# Altium project PCB_Project1.PrjPCB
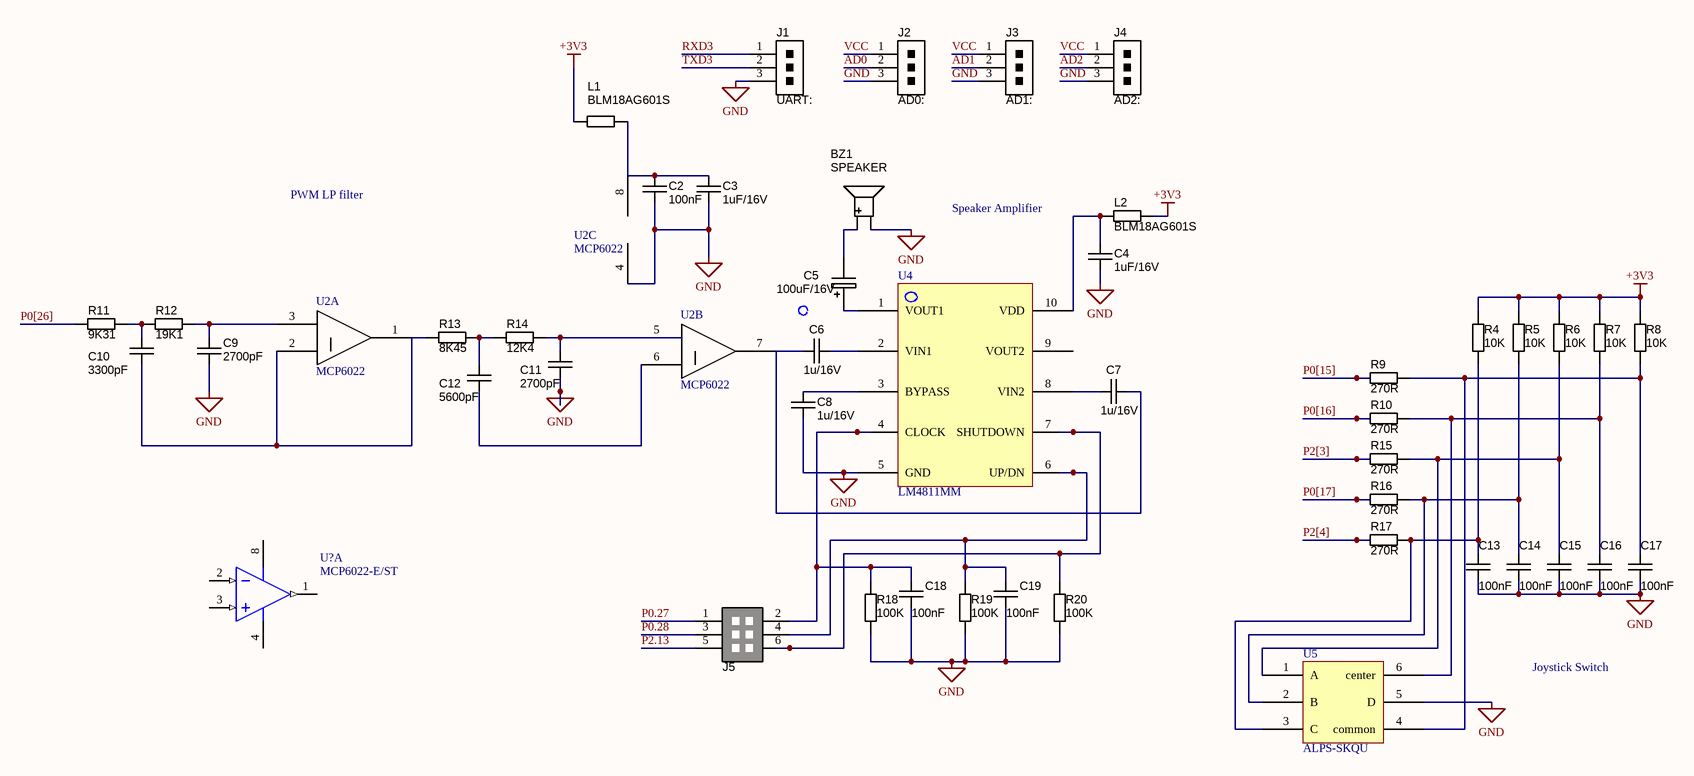
[diagram p0: Base Board.SchDoc]
6 sheets, 164 parts. Net scope: global (net labels, ports and power ports of the same name join across sheets).
Board file: PCB1.PcbDoc
Sheets:
  Base Board.SchDoc
  LPC1769.SchDoc
  SPI peripherals.SchDoc
  I2C-E2PROM.SchDoc
  USB Device.SchDoc
  Etherent.SchDoc

## Sheet Base Board.SchDoc
size A3; : 輸出入介面電路

### Parts
(Parts that share a designator on the sheet are numbered #1, #2 ... from top to bottom, then left to right.)
BZ1  Manufacturer Part Number 1: SPEAKER  [BUZZER_12.0X8.5MM]  (hidden comment: Alternate part: 3100-932)
C2  value 100nF  [CAPC2012N]  (hidden comment: approved sub OK)
C3  value 1uF/16V  [CAPC2012N]  (hidden comment: approved sub OK)
C4  value 1uF/16V  [CAPC2012N]  (hidden comment: approved sub OK)
C5  (no value)  [CAPMP3528X210N]
C6#1  value 1u/16V  [CAPC2012N]  (hidden comment: approved sub OK)
C7#1  value 1u/16V  [CAPC2012N]  (hidden comment: approved sub OK)
C8#1  value 1u/16V  [CAPC2012N]  (hidden comment: approved sub OK)
C9#1  value 2700pF  [CAPC2012N]  (hidden comment: approved sub OK)
C10#1  value 3300pF  [CAPC2012N]  (hidden comment: approved sub OK)
C11#1  value 2700pF  [CAPC2012N]  (hidden comment: approved sub OK)
C12#1  value 5600pF  [CAPC2012N]  (hidden comment: approved sub OK)
C13#1  value 100nF  [CAPC2012N]  (hidden comment: approved sub OK)
C14#1  value 100nF  [CAPC2012N]  (hidden comment: approved sub OK)
C15#1  value 100nF  [CAPC2012N]  (hidden comment: approved sub OK)
C16#1  value 100nF  [CAPC2012N]  (hidden comment: approved sub OK)
C17#1  value 100nF  [CAPC2012N]  (hidden comment: approved sub OK)
C18#1  value 100nF  [CAPC2012N]  (hidden comment: approved sub OK)
C19#1  value 100nF  [CAPC2012N]  (hidden comment: approved sub OK)
J1#1  CONN_HEADER_1x3P_0.100in  [1x3POS_HEADER]  (value not drawn)
J2#1  CONN_HEADER_1x3P_0.100in  [1x3POS_HEADER]  (value not drawn)
J3#1  CONN_HEADER_1x3P_0.100in  [1x3POS_HEADER]  (value not drawn)
J4  CONN_HEADER_1x3P_0.100in  [1x3POS_HEADER]  (value not drawn)
J5  micro-match socket  [6P_PCB_SOCKET_BRD_MNT_MICRO-MATCH]  (value not drawn)
L1  value BLM18AG601S  [RESC2012N]  (hidden comment: Thick Film)
L2  value BLM18AG601S  [RESC2012N]  (hidden comment: Thick Film)
R4  value 10K  [RESC2012N]  (hidden comment: Thick Film)
R5  value 10K  [RESC2012N]  (hidden comment: Thick Film)
R6  value 10K  [RESC2012N]  (hidden comment: Thick Film)
R7  value 10K  [RESC2012N]  (hidden comment: Thick Film)
R8  value 10K  [RESC2012N]  (hidden comment: Thick Film)
R9  value 270R  [RESC1005N]  (hidden comment: Thick Film)
R10  value 270R  [RESC1005N]  (hidden comment: Thick Film)
R11  value 9K31  [RESC1005N]  (hidden comment: Thick Film)
R12  value 19K1  [RESC1005N]  (hidden comment: Thick Film)
R13  value 8K45  [RESC1005N]  (hidden comment: Thick Film)
R14  value 12K4  [RESC1005N]  (hidden comment: Thick Film)
R15  value 270R  [RESC1005N]  (hidden comment: Thick Film)
R16  value 270R  [RESC1005N]  (hidden comment: Thick Film)
R17#1  value 270R  [RESC1005N]  (hidden comment: Thick Film)
R18#1  value 100K  [RESC1005N]  (hidden comment: Thick Film)
R19#1  value 100K  [RESC1005N]  (hidden comment: Thick Film)
R20#1  value 100K  [RESC1005N]  (hidden comment: Thick Film)
U2#1  MCP6022  [MSOP-UA8_L]  (parts A,B,C of 3)
U4#1  LM4811MM  [MSOP-UN10_N]
U5#1  ALPS-SKQU  [SOT-23-CH6_L]
U?  MCP6022-E/ST  [TSSOP-ST8_N]  (part A of 2)

### Nets
+3V3: L1.1 L2.2 R4.1 R5.1 R6.1 R7.1 R8.1
GND: BZ1.2(Negative) C2.1 C3.1 C4.1 C8#1.1 C9#1.2 C11#1.2 C13#1.2 C14#1.2 C15#1.2 C16#1.2 C17#1.2 C18#1.2 C19#1.2 J1#1.3 J2#1.3 J3#1.3 J4.3 R18#1.1 R19#1.1 R20#1.1 U4#1.5(GND) U5#1.5(D)
VCC: J2#1.1 J3#1.1 J4.1
AD0: J2#1.2
AD1: J3#1.2
AD2: J4.2
P0.27: J5.1
P0.28: J5.3
P0[15]: R9.1
P0[16]: R10.1
P0[17]: R16.1
P0[26]: R11.1
P2.13: J5.5
P2[3]: R15.1
P2[4]: R17#1.1  [project net BTN_DOWN]
RXD3: J1#1.1
TXD3: J1#1.2
NetBZ1_1: BZ1.1(Positive) C5.2
NetC2_2: C2.2 C3.2 L1.2
NetC4_2: C4.2 L2.1 U4#1.10(VDD)
NetC5_1: C5.1 U4#1.1(VOUT1)
NetC6#1_1: C6#1.1 C7#1.2
NetC6#1_2: C6#1.2 U4#1.2(VIN1)
NetC7#1_1: C7#1.1 U4#1.8(VIN2)
NetC8#1_2: C8#1.2 U4#1.3(BYPASS)
NetC9#1_1: C9#1.1 R12.2
NetC10#1_1: C10#1.1 R11.2 R12.1
NetC10#1_2: C10#1.2 R13.2
NetC11#1_1: C11#1.1 R14.2 U2#1.5(VINB+)
NetC12#1_1: C12#1.1 R13.1 R14.1
NetC13#1_1: C13#1.1 R4.2 R17#1.2 U5#1.3(C)
NetC14#1_1: C14#1.1 R5.2 R16.2 U5#1.2(B)
NetC15#1_1: C15#1.1 R6.2 R15.2 U5#1.1(A)
NetC16#1_1: C16#1.1 R7.2 R10.2 U5#1.6(center)
NetC17#1_1: C17#1.1 R8.2 R9.2 U5#1.4(common)
NetC18#1_1: C18#1.1 J5.2 R18#1.2 U4#1.4(CLOCK)
NetC19#1_1: C19#1.1 J5.4 R19#1.2 U4#1.6(UP/DN)
NetJ5_6: J5.6 R20#1.2 U4#1.7(SHUTDOWN)

Not connected (* = marked no-connect by the designer): C12#1 2; U2#1 1(VOUTA) 2(VINA-) 3(VINA+) 4(GND) 6(VINB-) 7(VOUTB) 8(VDD); U4#1 9(VOUT2); U? 1(VOUTA) 2(VINA-) 3(VINA+) 4(VSS) 8(VDD)

### Notes on the sheet
- PWM LP filter
- Speaker Amplifier
- Joystick Switch
- (in symbol CAPT_100u_1210_6V3) 100uF/16V

### Library data of the parts
BZ1 = BZ_12x8.5x6.5_2kHz: Speaker, Magnetic Transducer; Manufacturer 1: CUI Inc; Ratings: 2048 ?00 Hz; Package / Case: 6.5mm pitch; Material: Noryl SE1-J; Supplier 1: Digi-Key; Supplier Part Number 1: 102-1152-ND
C2-C4 C6#1 C7#1 C8#1 C9#1 C10#1 C11#1 C12#1 C13#1 C14#1 C15#1 C16#1 C17#1 C18#1 C19#1 = CAPC_100n_0805: Capacitor SMD Cer 100nF 10% 50V X7R 0805; Manufacturer 1: Kemet; Manufacturer Part Number 1: C0805C104K5RACTU; Tolerance: ?0%; Ratings: 50V; X7R; Material: ceramic; Package / Case: 0805 (2012 metric); Supplier 1: Digi-Key; Supplier Part Number 1: 399-1170-1-ND
C5 = CAPT_100u_1210_6V3: Capacitor SMD Tantalum 100uF 20% 6.3V 1210; Manufacturer 1: AVX Corporation; Manufacturer Part Number 1: TCJB107M006R0045; Tolerance: ?0%; Package / Case: 1210 (3528 Metric); Material: Tantalum; Supplier 1: Digi-Key; Supplier Part Number 1: 478-4711-1-ND
J1#1 J2#1 J3#1 J4 = CONN_HEADER_1x3P_0.100in: Pin Header, THT, Single-row, 2.54mm pitch; Manufacturer 1: 3M; Manufacturer Part Number 1: 929647-09-36-I; Pitch: 0.100" (2.54mm); Value: Single-row, 3 positions; QtyOverride: 0.1; Category: Connectors; Mounting Type: Through Hole; Terminal Block Type: Header, Male Pins, Single; Package / Case: Pin header; 2.54mm pitch
J5 = CONN_SOCKET_2x3P_0.100in_Female: Socket THD 6 POS Double-row 2.54mm pitch; Manufacturer 1: TE Connectivity; Manufacturer Part Number 1: 7-215079-6; Pitch: 0.100" (2.54mm); Value: Double-row, 14 positions; QtyOverride: 1; Connector Type: Receptacle; Number of Positions: 6; Package / Case: Connector header; 2.54mm pitch; Contact Type: Female Socket; Number of Rows: 2; Row Spacing: 0.100" (2.54mm); Contact Mating Length: 0.243" (6.17mm); ComponentLink1URL: http://multimedia.3m.com/mws/mediawebserver?66666UuZjcFSLXTtm8T_oxMcEVuQEcuZgVs6EVs6E666666--; ComponentLink1Description: http://multimedia.3m.com/mws/mediawebserver?66666UuZjcFSLXTtm8T_oxMcEVuQEcuZgVs6EVs6E666666--; Supplier 1: Digi-Key; Supplier Part Number 1: A30729CT-ND
L1 L2 R4-R8 = RES_10K_0805_5%: Resistor SMD chip 10k Ohm 0.125W 5% 0805; Manufacturer 1: Yageo; Manufacturer Part Number 1: RC0805JR-0710KL; Ratings: 1/8 W; Tolerance: ?%; Package / Case: 0805 (2012 metric); Material: Thick Film; Supplier 1: Digi-Key; Supplier Part Number 1: 311-10KARCT-ND
R9-R16 R17#1 R18#1 R19#1 R20#1 = RES_330R_0402_5%: Resistor SMD chip 330 Ohm 0.063W 5% 0402; Manufacturer 1: Yageo; Manufacturer Part Number 1: RC0402JR-07330RL; Ratings: 1/16 W; Tolerance: ?%; Package / Case: 0402 (1005 Metric); Supplier 1: Digi-Key; Supplier Part Number 1: 311-330JRCT-ND; ComponentLink1URL: http://www.yageo.com/documents/recent/PYu-RC0402_51_RoHS_L_6.pdf; ComponentLink1Description: http://www.yageo.com/documents/recent/PYu-RC0402_51_RoHS_L_6.pdf
U? = MCP6022-E/ST: Rail-to-Rail Input/Output, 10 MHz Operational Amplifier, 8-Pin TSSOP, Extended Temperature; Manufacturer: Microchip; DatasheetVersion: revD, Feb-2009; PackageVersion: revBB, Aug-2009; PackageReference: TSSOP-ST8; PackageDescription: 8-Lead Plastic Thin Shrink Small Outline (ST) - 4.4mm Body [TSSOP]; Supplier 1: Digi-Key; Supplier Part Number 1: MCP6022-E/ST-ND; Supplier 2: Farnell; Supplier Part Number 2: 1840887; Supplier 3: Newark; Supplier Part Number 3: 88H9882; Supplier 4: Mouser; Supplier Part Number 4: 579-MCP6022-E/ST; Mounting Technology: Surface Mount; Code_JEDEC: MO-153; PartNumber: MCP6022-E/ST; ComponentLink1Description: Manufacturer URL; ComponentLink1URL: http://www.microchip.com/; ComponentLink2Description: Datasheet; ComponentLink2URL: http://ww1.microchip.com/downloads/en/DeviceDoc/21685d.pdf; ComponentLink3Description: Package Specification; ComponentLink3URL: http://www.microchip.com/stellent/groups/techpub_sg/documents/packagingspec/en012702.pdf

## Sheet LPC1769.SchDoc: Motor Monitoring
size A3; Organization: NTUST EE-305; Address1: No.43, Sec. 4, Keelung Rd.; Address2: Da’an Dist.; Address3: Taipei 106; Address4: Taiwan (R.O.C.); Revision: 2.0; SheetNumber: 1; SheetTotal: 4
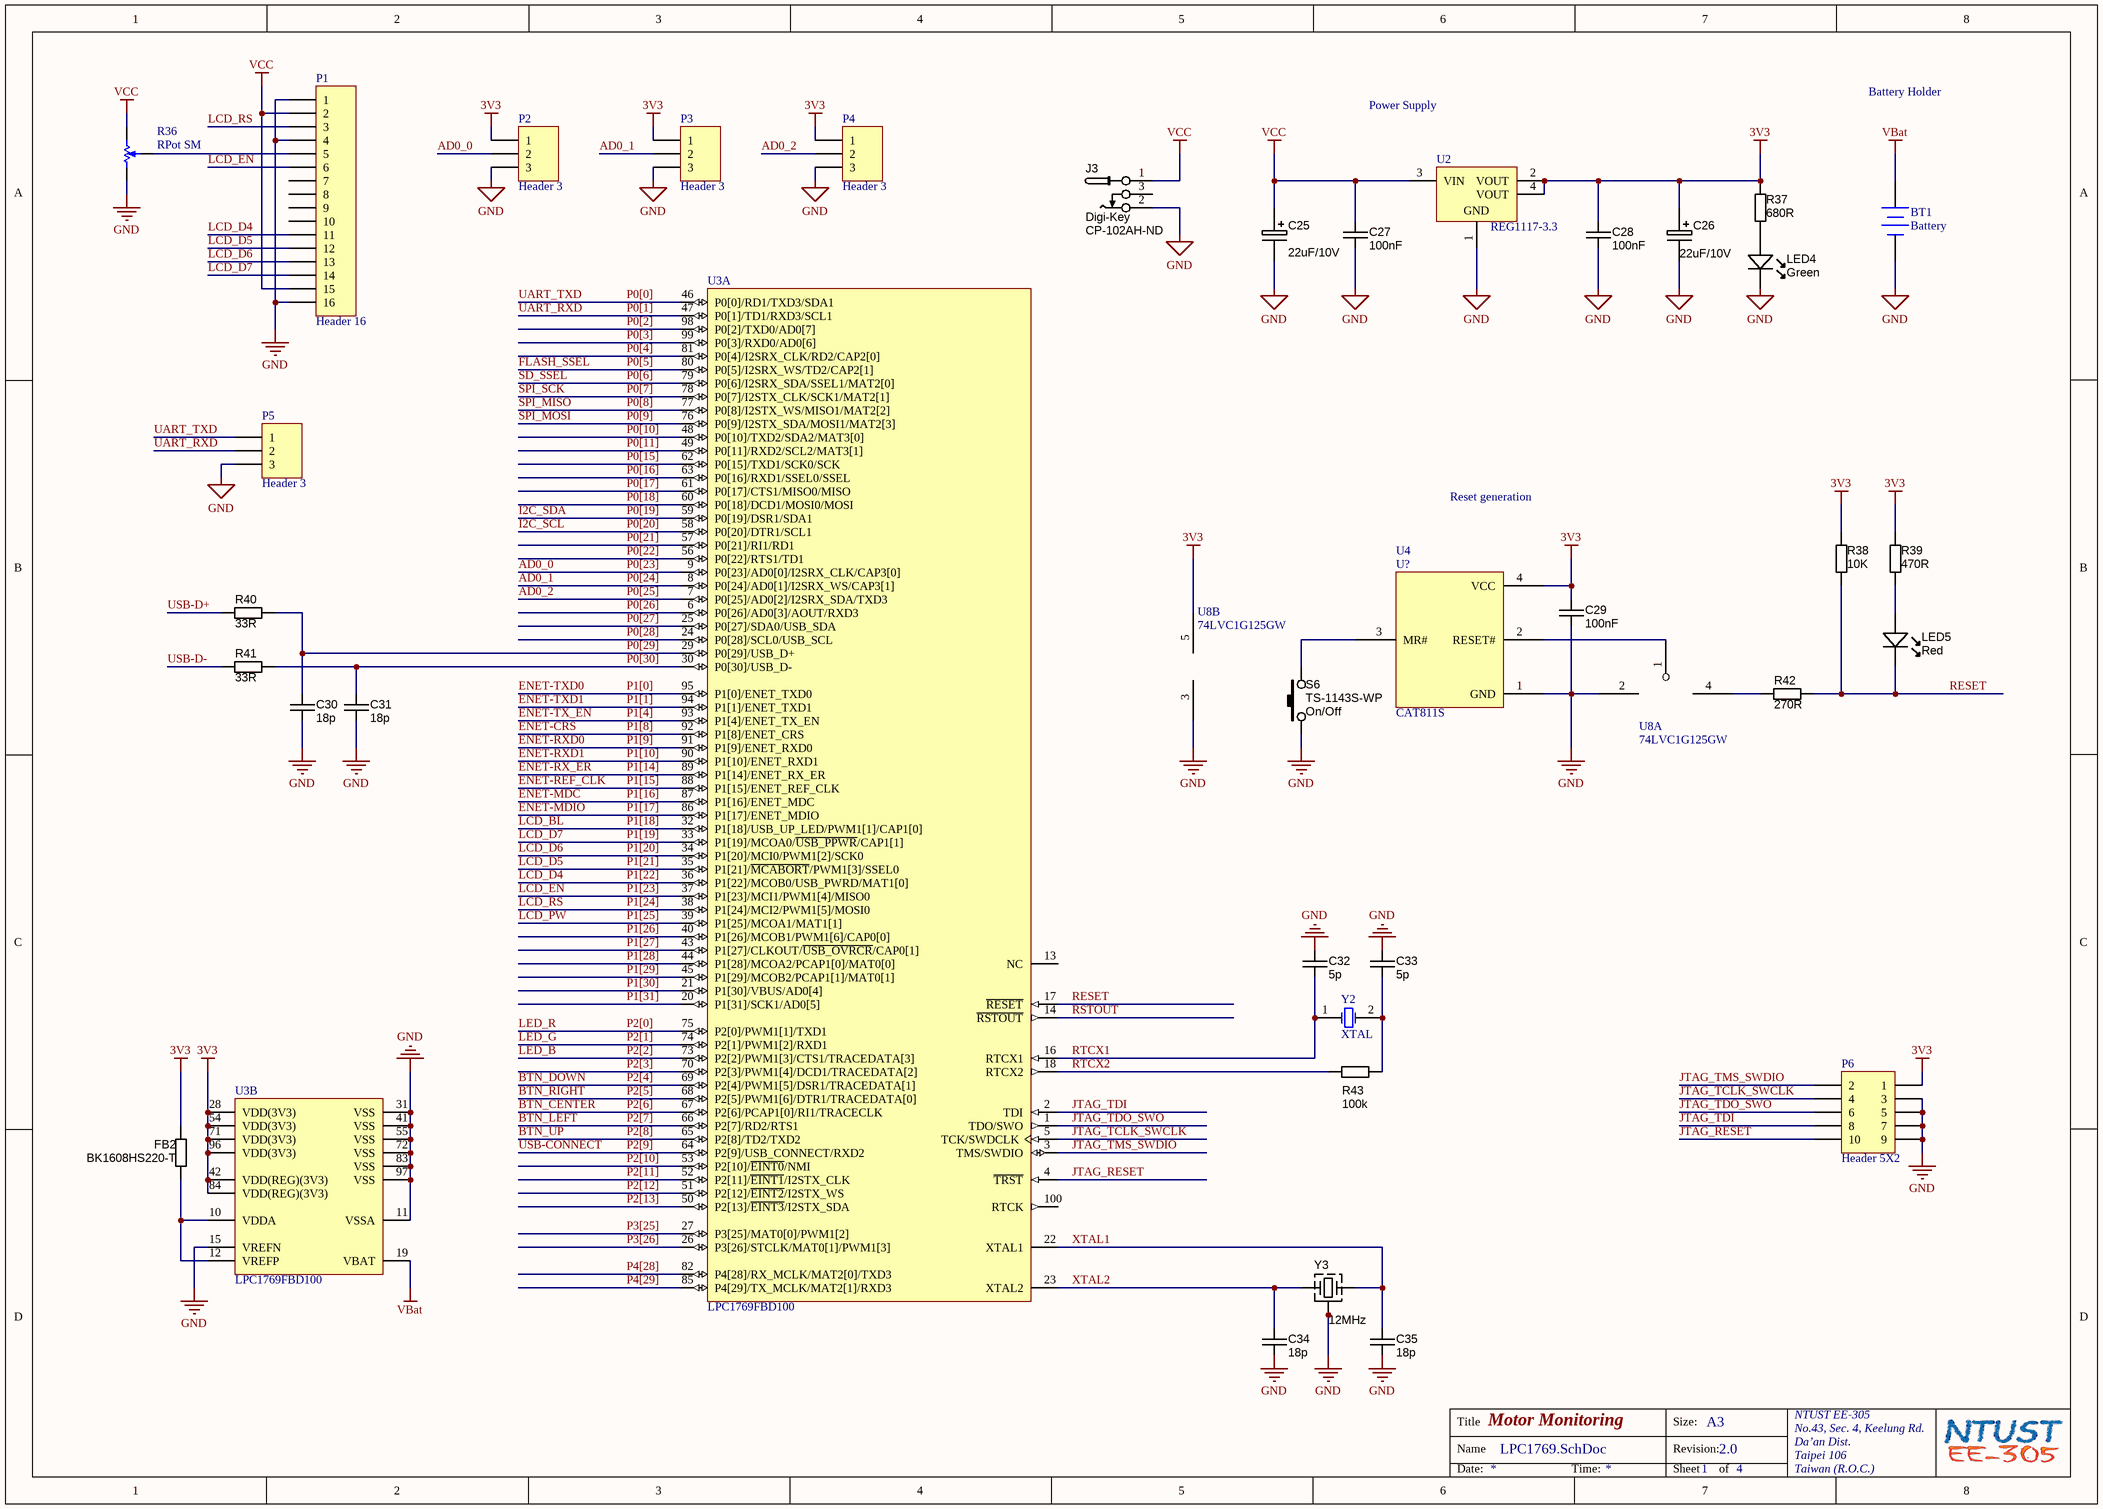
[diagram p1: LPC1769.SchDoc]

### Parts
(Parts that share a designator on the sheet are numbered #1, #2 ... from top to bottom, then left to right.)
BT1  Battery  [BAT-2]
C25  (no value)  [CAP_ELEC_5x5.7]
C26  (no value)  [CAP_ELEC_5x5.7]
C27  value 100nF  [CAPC1608N]  (hidden comment: approved sub OK)
C28  value 100nF  [CAPC1608N]  (hidden comment: approved sub OK)
C29  value 100nF  [CAPC1005N]  (hidden comment: approved sub OK)
C30  value 18p  [CAPC1608N]  (hidden comment: approved sub OK)
C31  value 18p  [CAPC1608N]  (hidden comment: approved sub OK)
C32  value 5p  [CAPC1005N]  (hidden comment: approved sub OK)
C33  value 5p  [CAPC1005N]  (hidden comment: approved sub OK)
C34  value 18p  [CAPC1005N]  (hidden comment: approved sub OK)
C35  value 18p  [CAPC1005N]  (hidden comment: approved sub OK)
FB2  value BK1608HS220-T  [RESC2012N]  (hidden comment: Thick Film)
J3#2  Supplier 1: Digi-Key  Supplier Part Number 1: CP-102AH-ND  [CONN_PWR_JACK_2.1x5.5mm]  (hidden comment: CONN_PWR_JACK_2.1x5.5mm)
LED4  Green  [LED-0603-GREEN]
LED5  Red  [LED-0603-GREEN]
P1  Header 16  [HDR1X16]
P2  Header 3  [HDR1X3]
P3  Header 3  [HDR1X3]
P4  Header 3  [HDR1X3]
P5  Header 3  [HDR1X3]
P6  Header 5X2  [Header 5x2p]
R36  RPot SM  [POT4MM-2]
R37  value 680R  [RESC1005N]  (hidden comment: Thick Film)
R38  value 10K  [RESC1005N]  (hidden comment: Thick Film)
R39#1  value 470R  [RESC1005N]  (hidden comment: Thick Film)
R40#1  value 33R  [RESC1608N]  (hidden comment: Thick Film)
R41  value 33R  [RESC1608N]  (hidden comment: Thick Film)
R42  value 270R  [RESC1005N]  (hidden comment: Thick Film)
R43  value 100k  [RESC1005N]  (hidden comment: Thick Film)
S6  TS-1143S-WP  Function: On/Off  [TS-1143S]
U2#2  REG1117-3.3  [TI-DCY4_N]
U3  LPC1769FBD100  [SOT407-1_V]  (parts A,B of 2)
U4#2  CAT811S  [SOT-143-RC4_N]
U8  74LVC1G125GW  [SOT-23-CT5_N]  (parts A,B of 2)
Y2  XTAL  [HC49/4H_SMX]
Y3  12MHz  [CRYSTAL_4-LCC]

### Nets
3V3: C26.1 C28.2 C29.1 FB2.2 P2.1 P3.1 P4.1 P6.1 R37.2 R38.2 R39#1.2 U2#2.2(VOUT) U2#2.4(VOUT) U3.28(VDD(3V3)) U3.42(VDD(REG)(3V3)) U3.54(VDD(3V3)) U3.71(VDD(3V3)) U3.84(VDD(REG)(3V3)) U3.96(VDD(3V3)) U4#2.4(VCC) U8.5(VCC)
GND: BT1.2(-) C25.2 C26.2 C27.2 C28.1 C29.2 C30.1 C31.1 C32.2 C33.2 C34.1 C35.1 J3#2.2 LED4.K P1.1 P1.4 P1.16 P2.3 P3.3 P4.3 P5.3 P6.3 P6.5 P6.7 P6.9 R36.CCW(-) S6.1 U2#2.1(GND) U3.11(VSSA) U3.15(VREFN) U3.31(VSS) U3.41(VSS) U3.55(VSS) U3.72(VSS) U3.83(VSS) U3.97(VSS) U4#2.1(GND) U8.2(A) U8.3(GND) Y3.2(GND) Y3.4(GND)
VBat: BT1.1(+) U3.19(VBAT)
VCC: C25.1 C27.1 J3#2.1 P1.2 P1.15 R36.CW(+) U2#2.3(VIN)
AD0_0: P2.2 U3.9(P0[23]/AD0[0]/I2SRX_CLK/CAP3[0])  [also labelled P0[23]]
AD0_1: P3.2 U3.8(P0[24]/AD0[1]/I2SRX_WS/CAP3[1])  [also labelled P0[24]]
AD0_2: P4.2 U3.7(P0[25]/AD0[2]/I2SRX_SDA/TXD3)  [also labelled P0[25]]
BTN_CENTER: U3.67(P2[6]/PCAP1[0]/RI1/TRACECLK)  [also labelled P2[6]]
BTN_DOWN: U3.69(P2[4]/PWM1[5]/DSR1/TRACEDATA[1])  [also labelled P2[4]]
BTN_LEFT: U3.66(P2[7]/RD2/RTS1)  [also labelled P2[7]]
BTN_RIGHT: U3.68(P2[5]/PWM1[6]/DTR1/TRACEDATA[0])  [also labelled P2[5]]
BTN_UP: U3.65(P2[8]/TD2/TXD2)  [also labelled P2[8]]
ENET-CRS: U3.92(P1[8]/ENET_CRS)  [also labelled P1[8]]
ENET-MDC: U3.87(P1[16]/ENET_MDC)  [also labelled P1[16]]
ENET-MDIO: U3.86(P1[17]/ENET_MDIO)  [also labelled P1[17]]
ENET-REF_CLK: U3.88(P1[15]/ENET_REF_CLK)  [also labelled P1[15]]
ENET-RX_ER: U3.89(P1[14]/ENET_RX_ER)  [also labelled P1[14]]
ENET-RXD0: U3.91(P1[9]/ENET_RXD0)  [also labelled P1[9]]
ENET-RXD1: U3.90(P1[10]/ENET_RXD1)  [also labelled P1[10]]
ENET-TX_EN: U3.93(P1[4]/ENET_TX_EN)  [also labelled P1[4]]
ENET-TXD0: U3.95(P1[0]/ENET_TXD0)  [also labelled P1[0]]
ENET-TXD1: U3.94(P1[1]/ENET_TXD1)  [also labelled P1[1]]
FLASH_SSEL: U3.80(P0[5]/I2SRX_WS/TD2/CAP2[1])  [also labelled P0[5]]
I2C_SCL: U3.58(P0[20]/DTR1/SCL1)  [also labelled P0[20]]
I2C_SDA: U3.59(P0[19]/DSR1/SDA1)  [also labelled P0[19]]
JTAG_RESET: P6.10 U3.4(~{TRST})
JTAG_TCLK_SWCLK: P6.4 U3.5(TCK/SWDCLK)
JTAG_TDI: P6.8 U3.2(TDI)
JTAG_TDO_SWO: P6.6 U3.1(TDO/SWO)
JTAG_TMS_SWDIO: P6.2 U3.3(TMS/SWDIO)
LCD_BL: U3.32(P1[18]/USB_UP_LED/PWM1[1]/CAP1[0])  [also labelled P1[18]]
LCD_D4: P1.11 U3.36(P1[22]/MCOB0/USB_PWRD/MAT1[0])  [also labelled P1[22]]
LCD_D5: P1.12 U3.35(P1[21]/~{MCABORT}/PWM1[3]/SSEL0)  [also labelled P1[21]]
LCD_D6: P1.13 U3.34(P1[20]/MCI0/PWM1[2]/SCK0)  [also labelled P1[20]]
LCD_D7: P1.14 U3.33(P1[19]/MCOA0/~{USB_PPWR}/CAP1[1])  [also labelled P1[19]]
LCD_EN: P1.6 U3.37(P1[23]/MCI1/PWM1[4]/MISO0)  [also labelled P1[23]]
LCD_PW: U3.39(P1[25]/MCOA1/MAT1[1])  [also labelled P1[25]]
LCD_RS: P1.3 U3.38(P1[24]/MCI2/PWM1[5]/MOSI0)  [also labelled P1[24]]
LED_B: U3.73(P2[2]/PWM1[3]/CTS1/TRACEDATA[3])  [also labelled P2[2]]
LED_G: U3.74(P2[1]/PWM1[2]/RXD1)  [also labelled P2[1]]
LED_R: U3.75(P2[0]/PWM1[1]/TXD1)  [also labelled P2[0]]
P0[0]: P5.1 U3.46(P0[0]/RD1/TXD3/SDA1)  [also labelled UART_TXD]
P0[1]: P5.2 U3.47(P0[1]/TD1/RXD3/SCL1)  [also labelled UART_RXD]
P0[2]: U3.98(P0[2]/TXD0/AD0[7])
P0[3]: U3.99(P0[3]/RXD0/AD0[6])
P0[4]: U3.81(P0[4]/I2SRX_CLK/RD2/CAP2[0])
P0[6]: U3.79(P0[6]/I2SRX_SDA/SSEL1/MAT2[0])  [also labelled SD_SSEL]
P0[7]: U3.78(P0[7]/I2STX_CLK/SCK1/MAT2[1])  [also labelled SPI_SCK]
P0[8]: U3.77(P0[8]/I2STX_WS/MISO1/MAT2[2])  [also labelled SPI_MISO]
P0[9]: U3.76(P0[9]/I2STX_SDA/MOSI1/MAT2[3])  [also labelled SPI_MOSI]
P0[10]: U3.48(P0[10]/TXD2/SDA2/MAT3[0])
P0[11]: U3.49(P0[11]/RXD2/SCL2/MAT3[1])
P0[15]: U3.62(P0[15]/TXD1/SCK0/SCK)
P0[16]: U3.63(P0[16]/RXD1/SSEL0/SSEL)
P0[17]: U3.61(P0[17]/CTS1/MISO0/MISO)
P0[18]: U3.60(P0[18]/DCD1/MOSI0/MOSI)
P0[21]: U3.57(P0[21]/RI1/RD1)
P0[22]: U3.56(P0[22]/RTS1/TD1)
P0[26]: U3.6(P0[26]/AD0[3]/AOUT/RXD3)
P0[27]: U3.25(P0[27]/SDA0/USB_SDA)
P0[28]: U3.24(P0[28]/SCL0/USB_SCL)
P0[29]: C30.2 R40#1.1 U3.29(P0[29]/USB_D+)
P0[30]: C31.2 R41.1 U3.30(P0[30]/USB_D-)
P1[26]: U3.40(P1[26]/MCOB1/PWM1[6]/CAP0[0])
P1[27]: U3.43(P1[27]/CLKOUT/~{USB_OVRCR}/CAP0[1])
P1[28]: U3.44(P1[28]/MCOA2/PCAP1[0]/MAT0[0])
P1[29]: U3.45(P1[29]/MCOB2/PCAP1[1]/MAT0[1])
P1[30]: U3.21(P1[30]/VBUS/AD0[4])
P1[31]: U3.20(P1[31]/SCK1/AD0[5])
P2[3]: U3.70(P2[3]/PWM1[4]/DCD1/TRACEDATA[2])
P2[9]: U3.64(P2[9]/USB_CONNECT/RXD2)  [also labelled USB-CONNECT]
P2[10]: U3.53(P2[10]/~{EINT0}/NMI)
P2[11]: U3.52(P2[11]/~{EINT1}/I2STX_CLK)
P2[12]: U3.51(P2[12]/~{EINT2}/I2STX_WS)
P2[13]: U3.50(P2[13]/~{EINT3}/I2STX_SDA)
P3[25]: U3.27(P3[25]/MAT0[0]/PWM1[2])
P3[26]: U3.26(P3[26]/STCLK/MAT0[1]/PWM1[3])
P4[28]: U3.82(P4[28]/RX_MCLK/MAT2[0]/TXD3)
P4[29]: U3.85(P4[29]/TX_MCLK/MAT2[1]/RXD3)
RESET: LED5.K R38.1 R42.1 U3.17(~{RESET})
RSTOUT: U3.14(~{RSTOUT})
RTCX1: C32.1 U3.16(RTCX1) Y2.1(OSC1)
RTCX2: R43.2 U3.18(RTCX2)
USB-D+: R40#1.2
USB-D-: R41.2
XTAL1: C35.2 U3.22(XTAL1) Y3.3(X)
XTAL2: C34.2 U3.23(XTAL2) Y3.1(X)
NetC33_1: C33.1 R43.1 Y2.2(OSC2)
NetFB2_1: FB2.1 U3.10(VDDA) U3.12(VREFP)
NetLED4_A: LED4.A R37.1
NetLED5_A: LED5.A R39#1.1
NetP1_5: P1.5 R36.W
NetR42_2: R42.2 U8.4(Y)
NetS6_2: S6.2 U4#2.3(MR#)
NetU4#2_2: U4#2.2(RESET#) U8.1(~{OE})

Not connected (* = marked no-connect by the designer): J3#2 3; P1 7 8 9 10; U3 13(NC) 100(RTCK)

### Notes on the sheet
- Power Supply
- Battery Holder
- Reset generation
- Title
- Name
- Size:
- Revision:
- A3
- Date:
- Time:
- Sheet
- of
- (in symbol CAPT_100u_1210_6V3) 22uF/10V
- (in symbol CAT811S) U?

### Library data of the parts
BT1 = Battery: Multicell Battery; Published: 24-Mar-1999; LatestRevisionDate: 17-Jul-2002; LatestRevisionNote: Re-released for DXP Platform.; PackageReference: BAT-2; Publisher: Altium Limited; PackageDescription: Battery; 2 Leads
C25 C26 = CAPT_100u_1210_6V3: as C5 on sheet Base Board; Package / Case: 1210 (3528 Metric); Material: Tantalum; Supplier 1: Digi-Key; Supplier Part Number 1: 478-4711-1-ND
C27-C35 = CAPC_100n_0805: as C2 on sheet Base Board; Package / Case: 0805 (2012 metric); Supplier 1: Digi-Key; Supplier Part Number 1: 399-1170-1-ND
FB2 R38 R40#1 R41 R43 = RES_10K_0805_5%: as L1 on sheet Base Board; Package / Case: 0805 (2012 metric); Material: Thick Film; Supplier 1: Digi-Key; Supplier Part Number 1: 311-10KARCT-ND
J3#2 = CONN_PWR_JACK_2.1x5.5mm: Power Connector, THT, 2.1mm ID, 5.5mm OD; Manufacturer 1: CUI Inc; Manufacturer Part Number 1: PJ-102AH; Category: Connectors; Mounting Type: Through Hole; Package / Case: PCB mount; Value: 2.1mm ID, 5.5mm OD
LED4 = LED_SMD_Green_0805_8mcd: LED, 0805 SMD, Green; Manufacturer 1: Ligitek; Manufacturer Part Number 1: LG-170PG-CT; Material: GaP; Ratings: 8 mcd; 558 nm; Package / Case: 0805
LED5 = LED_SMD_Red_0805: LED, 0805 SMD, Red; Manufacturer 1: Ligitek; Manufacturer Part Number 1: LG170SR-CT; Material: GaAIAs; Ratings: 20 mcd; 643 nm; Package / Case: 0805
P1 = Header 16: Header, 16-Pin; LatestRevisionDate: 17-Jul-2002; LatestRevisionNote: Re-released for DXP Platform.; Publisher: Altium Limited
P2-P5 = Header 3: Header, 3-Pin; LatestRevisionDate: 17-Jul-2002; LatestRevisionNote: Re-released for DXP Platform.; Publisher: Altium Limited
P6 = Header 5X2: Header, 5-Pin, Dual row; LatestRevisionDate: 17-Jul-2002; LatestRevisionNote: Re-released for DXP Platform.; Publisher: Altium Limited
R36 = RPot SM: Square Trimming Potentiometer; Published: 17-Dec-2003; DatasheetVersion: Oct-2003; PackageReference: POT4MM-2; Publisher: Altium Limited; PackageDescription: Square Trimming Potentiometer; ComponentLink1Description: Manufacturer Link; ComponentLink1URL: http://bourns.com/2/search.html
R37 R42 = RES_330R_0402_5%: as R9 on sheet Base Board; Package / Case: 0402 (1005 Metric); Supplier 1: Digi-Key; Supplier Part Number 1: 311-330JRCT-ND; ComponentLink1URL: http://www.yageo.com/documents/recent/PYu-RC0402_51_RoHS_L_6.pdf; ComponentLink1Description: http://www.yageo.com/documents/recent/PYu-RC0402_51_RoHS_L_6.pdf
R39#1 = RES_470R_0603_5%: Resistor SMD chip 470 Ohm 0.1W 5% 0603; Manufacturer 1: Vishay/Dale; Manufacturer Part Number 1: CRCW0603470RJNEA; Ratings: 1/10 W; Tolerance: ?%; Package / Case: 0603 (1608 metric); Material: Thick Film; Supplier 1: Digi-Key; Supplier Part Number 1: 541-470GCT-ND
S6 = SW_SMD_PB_4.3mm: Switch SMD Tact 4.3mm Stem; Manufacturer 1: Bond-Tact; Manufacturer Part Number 1: TS-1143S-WP-200; Package / Case: 6.5x6.5mm; 4.3mm stem
U2#2 = REG1117-3.3: Single Output LDO, 800 mA, Fixed 3.3 V Output, 3.8 to 15 V Input, with Internal Current Limiting, 4-pin SOT-223 (DCY), -40 to 125 degC, Green (RoHS & no Sb/Br); Manufacturer: Texas Instruments; Fixed Output Options(V): 5; Iout(Max)(A): 0.8; Iq(Typ)(mA): 4; Rating: Catalog; SubFamily: Single Channel LDO; Vdo(Typ)(mV): 1100; Vin(Max)(V): 15; Vin(Min)(V): 3.8; Vout Adj(Max)(V): 3.3; DatasheetVersion: SBVS001D; PackageVersion: 4202506/B; PackageReference: DCY4; PackageDescription: 4-Pin Plastic Small Outline, Body 3.5 x 6.5 mm, Pitch 2.3 mm; Supplier 1: Digi-Key; Supplier Part Number 1: REG1117-3.3-ND; Supplier 2: Farnell; Supplier Part Number 2: 1212355; Supplier 3: Farnell; Supplier Part Number 3: 2126471; Supplier 4: Newark; Supplier Part Number 4: 35C1963; Supplier 5: Mouser; Supplier Part Number 5: 595-REG1117-3.3; Eco-Plan: Green (RoHS & no Sb/Br); Vout Adj(Min)(V): 3.3; Mounting Technology: Surface Mount; Code_JEDEC: TO-261; PartNumber: REG1117-3.3; ComponentLink1Description: Manufacturer URL; ComponentLink1URL: http://www.ti.com/; ComponentLink2Description: Datasheet; ComponentLink2URL: http://www.ti.com/general/docs/lit/getliterature.tsp?genericPartNumber=REG1117-33&fileType=pdf; ComponentLink3Description: Package Specification; ComponentLink3URL: http://www.ti.com/litv/pdf/mpds094a
U3 = LPC1769FBD100: 32-bit ARM Cortex-M3 MCU, 512 kB Flash, 64 kB SRAM, Ethernet, USB 2.0 Device/Host/OTG, 12-Bit ADC, DAC, I2S, 100-Pin LQFP; fmax: 120 MHz; SRAM: 64 kB; Flash: 512 kB; GPIOs: 70; USB: 1; CAN: 2; UART: 4; PWM: 6; PLL: Y; ADC channels: 8; VDD (min): 2.4 V; VDD (typ): 3.3 V; VDD (max): 3.6 V; Code_IEC: 136E20; DatasheetVersion: Rev. 8, Nov-2011; PackageVersion: Feb-2003; PackageReference: SOT407-1; PackageDescription: LQFP100: Plastic Low Profile Quad Flat Package; 100 Leads; Body 14 x 14 x 1.4 mm; SPI: 1; SSP: 2; Timers: 4; Code_JEDEC: MS-026; PartNumber: LPC1769FBD100; ComponentLink1Description: Manufacturer URL; ComponentLink1URL: http://www.nxp.com/; ComponentLink2Description: Datasheet; ComponentLink2URL: http://www.nxp.com/documents/data_sheet/LPC1769_68_67_66_65_64_63.pdf
Y2 = XTAL: Crystal Oscillator; Published: 8-Jun-2000; LatestRevisionDate: 17-Jul-2002; LatestRevisionNote: Re-released for DXP Platform.; PackageReference: R38; Publisher: Altium Limited; PackageDescription: Crystal, Thru-Hole; 2 Leads; Body 3.1 x 8.2 mm (Dia.xH)
Y3 = CRYSTAL_27M12: Oscillator Crystal 27.12 MHz 10ppm; Manufacturer 1: TXC CORPORATION; Manufacturer Part Number 1: 7M-27.120MEEQ-T; Ratings: 4.9152 MHz Crystal; Frequency Stability: ?0ppm; Load Capacitance: 10pF; Operating Mode: Fundamental; Package / Case: 2.5mm pitch; Material: Ceramic; Supplier 1: Digi-Key; Supplier Part Number 1: 887-1329-1-ND; Type: MHz Crystal; Frequency Tolerance: ?0ppm; Operating Temperature: -20蚓 ~ 70蚓; Mounting Type: Surface Mount; Size / Dimension: 0.126" L x 0.098" W (3.20mm x 2.50mm); ComponentLink1URL: http://www.txccrystal.com/images/pdf/7m-accuracy.pdf; ComponentLink1Description: http://www.txccrystal.com/images/pdf/7m-accuracy.pdf

## Sheet SPI peripherals.SchDoc: Motor Monitoring
size A3; Organization: NTUST EE-305; Address1: No.43, Sec. 4, Keelung Rd.; Address2: Da’an Dist.; Address3: Taipei 106; Address4: Taiwan (R.O.C.); Revision: 2.0; SheetNumber: 3; SheetTotal: 4
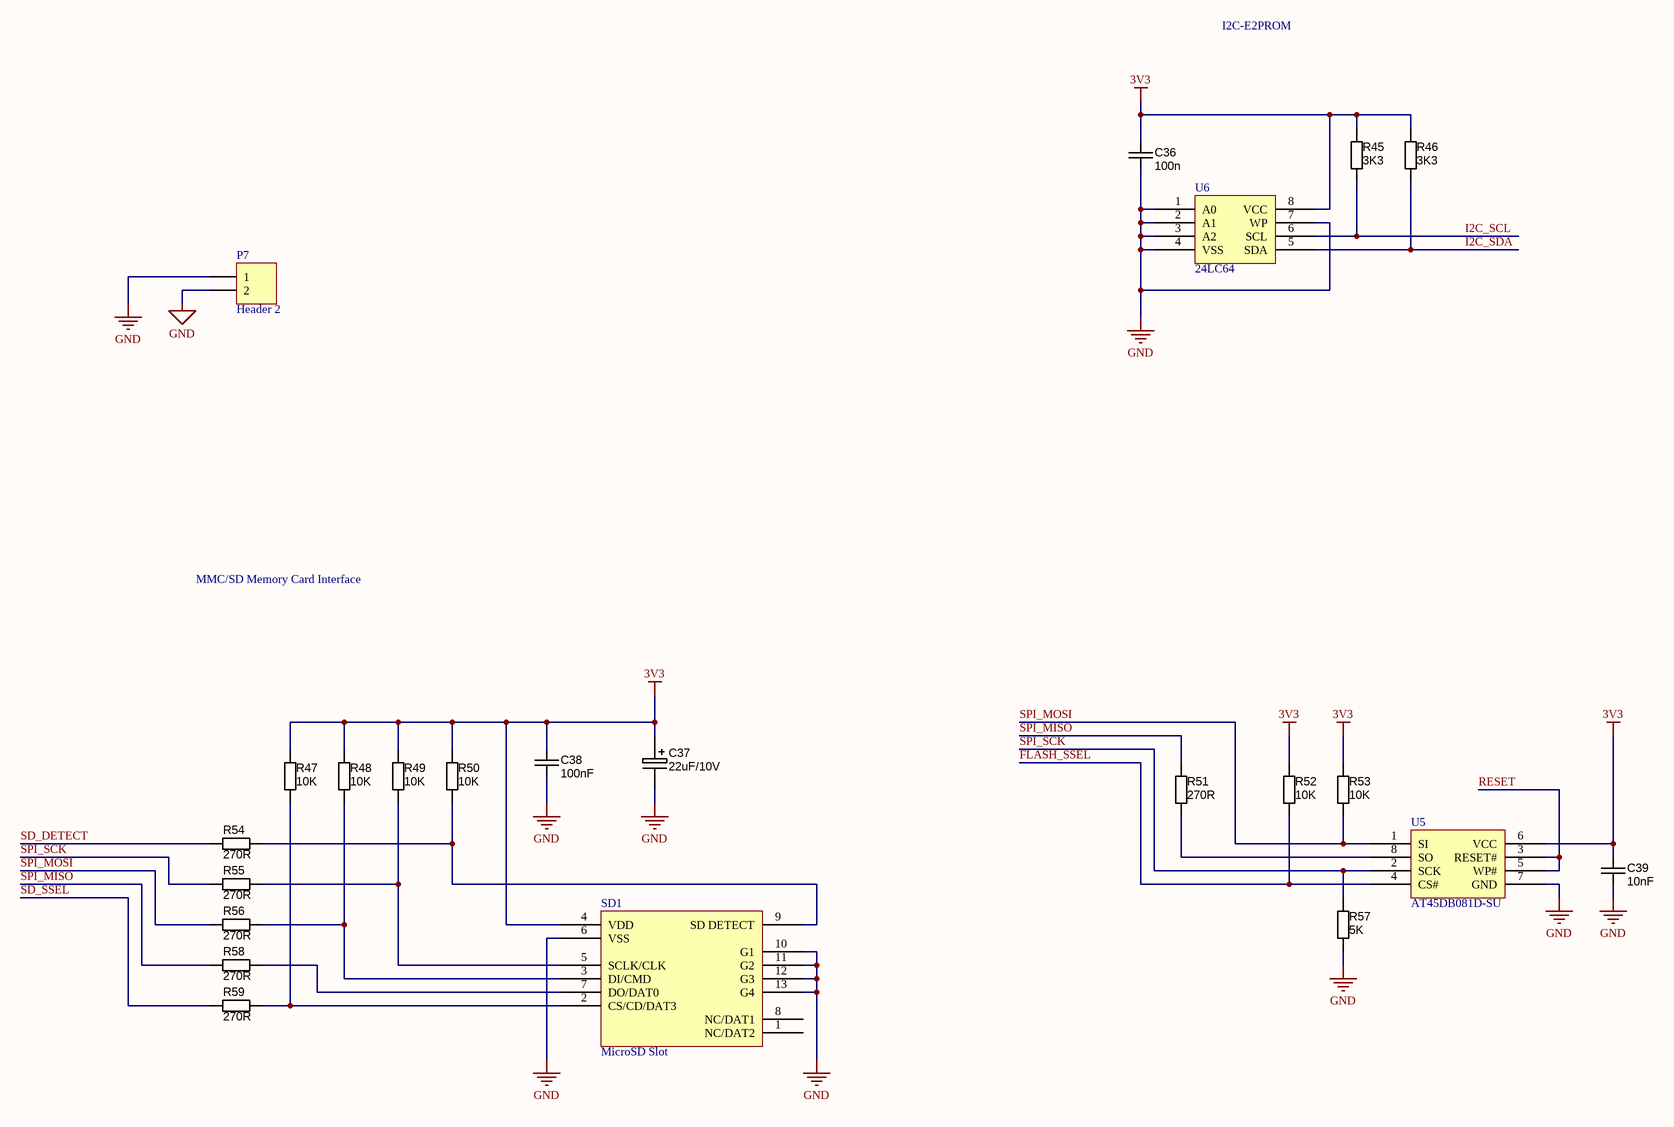
[diagram p2: SPI peripherals.SchDoc]

### Parts
(Parts that share a designator on the sheet are numbered #1, #2 ... from top to bottom, then left to right.)
C36  value 100n  [CAPC1608N]  (hidden comment: approved sub OK)
C37  Ratings: 22uF/10V  [CAPC3216N]
C38  value 100nF  [CAPC1608N]  (hidden comment: approved sub OK)
C39  value 10nF  [CAPC1608N]  (hidden comment: approved sub OK)
P7  Header 2  [HDR1X2]
R45  value 3K3  [RESC1005N]  (hidden comment: Thick Film)
R46  value 3K3  [RESC1005N]  (hidden comment: Thick Film)
R47  value 10K  [RESC1005N]  (hidden comment: Thick Film)
R48  value 10K  [RESC1005N]  (hidden comment: Thick Film)
R49  value 10K  [RESC1005N]  (hidden comment: Thick Film)
R50  value 10K  [RESC1005N]  (hidden comment: Thick Film)
R51  value 270R  [RESC1005N]  (hidden comment: Thick Film)
R52  value 10K  [RESC1005N]  (hidden comment: Thick Film)
R53  value 10K  [RESC1005N]  (hidden comment: Thick Film)
R54  value 270R  [RESC1005N]  (hidden comment: Thick Film)
R55  value 270R  [RESC1005N]  (hidden comment: Thick Film)
R56  value 270R  [RESC1005N]  (hidden comment: Thick Film)
R57  value 5K  [RESC1005N]  (hidden comment: Thick Film)
R58  value 270R  [RESC1005N]  (hidden comment: Thick Film)
R59  value 270R  [RESC1005N]  (hidden comment: Thick Film)
SD1  MicroSD Slot  [MICROSD Slot]
U5#2  AT45DB081D-SU  [SOIJ-SM8_N]
U6  24LC64  [SOIJ-SM8_N]

### Nets
3V3: C36.1 C37.1 C38.1 C39.2 R45.1 R46.1 R47.2 R48.2 R49.2 R50.2 R52.1 R53.1 SD1.4(VDD) U5#2.6(VCC) U6.8(VCC)
GND: C36.2 C37.2 C38.2 C39.1 P7.1 P7.2 R57.2 SD1.6(VSS) SD1.10(G1) SD1.11(G2) SD1.12(G3) SD1.13(G4) U5#2.7(GND) U6.1(A0) U6.2(A1) U6.3(A2) U6.4(VSS) U6.7(WP)
FLASH_SSEL: R52.2 U5#2.4(CS#)
I2C_SCL: R45.2 U6.6(SCL)
I2C_SDA: R46.2 U6.5(SDA)
RESET: U5#2.3(RESET#) U5#2.5(WP#)
SD_DETECT: R54.2
SD_SSEL: R59.2  [project net P0[6]]
SPI_MISO: R51.1 R58.2  [project net P0[8]]
SPI_MOSI: R53.2 R56.2 U5#2.1(SI)  [project net P0[9]]
SPI_SCK: R55.2 R57.1 U5#2.2(SCK)  [project net P0[7]]
NetR47_1: R47.1 R59.1 SD1.2(CS/CD/DAT3)
NetR48_1: R48.1 R56.1 SD1.3(DI/CMD)
NetR49_1: R49.1 R55.1 SD1.5(SCLK/CLK)
NetR50_1: R50.1 R54.1 SD1.9(SD_DETECT)
NetR51_2: R51.2 U5#2.8(SO)
NetR58_1: R58.1 SD1.7(DO/DAT0)

Not connected (* = marked no-connect by the designer): SD1 1(NC/DAT2) 8(NC/DAT1)

### Notes on the sheet
- I2C-E2PROM
- MMC/SD Memory Card Interface
- Title
- Name
- Size:
- Revision:
- A3
- Date:
- Time:
- Sheet
- of

### Library data of the parts
C36 C38 C39 = CAPC_100n_0805: as C2 on sheet Base Board; Package / Case: 0805 (2012 metric); Supplier 1: Digi-Key; Supplier Part Number 1: 399-1170-1-ND
C37 = CAPT_1u_0805_10V: Capacitor SMD Tantalum 1uF 20% 10V 0805; Manufacturer 1: AVX Corporation; Manufacturer Part Number 1: TAJP106M010RNJ; Manufacturer Size Code: P; Tolerance: ?0%; ESR (Equivalent Series Resistance): 6.000 Ohm; Type: Molded; Operating Tem: -55蚓 ~ 125蚓; Package / Case: 0805 (2012 metric); Material: Tantalum; Supplier 1: Digi-Key; Supplier Part Number 1: 478-3281-1-ND; Size / Dimension: 0.081" L x 0.053" W (2.05mm x 1.35mm); Height - Seated (Max): 0.059" (1.50mm); ComponentLink1URL: http://www.avx.com/docs/Catalogs/tajlp.pdf; ComponentLink1Description: http://www.avx.com/docs/Catalogs/tajlp.pdf
P7 = Header 2: Header, 2-Pin; LatestRevisionDate: 17-Jul-2002; LatestRevisionNote: Re-released for DXP Platform.; Publisher: Altium Limited
R45-R59 = RES_330R_0402_5%: as R9 on sheet Base Board; Package / Case: 0402 (1005 Metric); Supplier 1: Digi-Key; Supplier Part Number 1: 311-330JRCT-ND; ComponentLink1URL: http://www.yageo.com/documents/recent/PYu-RC0402_51_RoHS_L_6.pdf; ComponentLink1Description: http://www.yageo.com/documents/recent/PYu-RC0402_51_RoHS_L_6.pdf

## Sheet I2C-E2PROM.SchDoc: I2C-E2PROM
size A4
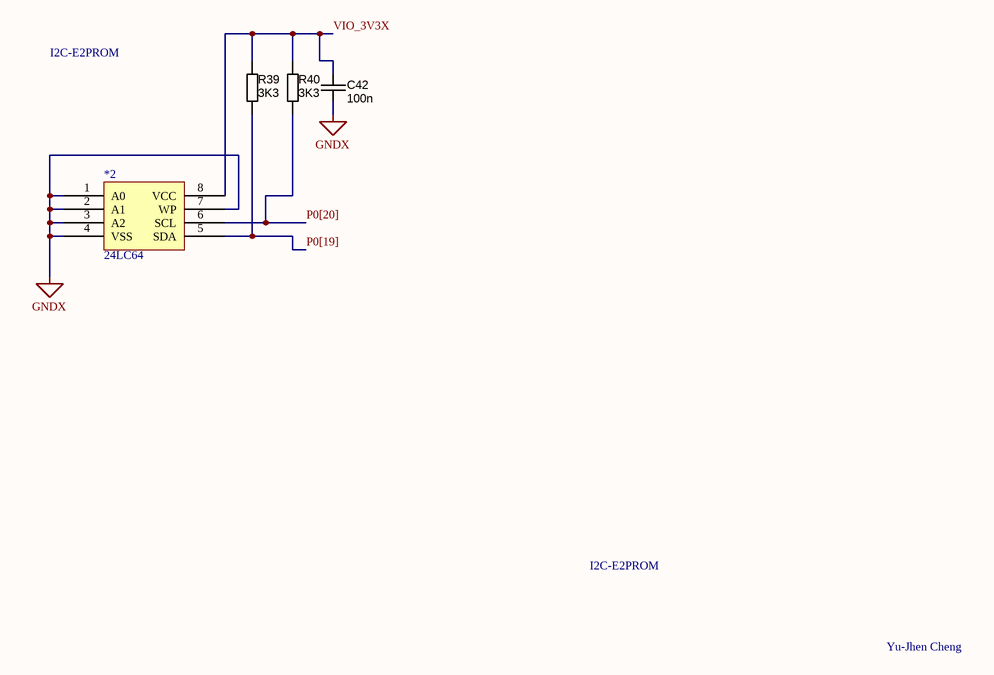
[diagram p3: I2C-E2PROM.SchDoc]

### Parts
(Parts that share a designator on the sheet are numbered #1, #2 ... from top to bottom, then left to right.)
*2  24LC64  [DFN-MD8]
C42  value 100n  [CAPC2012N]  (hidden comment: approved sub OK)
R39#2  value 3K3  [RESC1005N]  (hidden comment: Thick Film)
R40#2  value 3K3  [RESC1005N]  (hidden comment: Thick Film)

### Nets
GNDX: *2.1(A0) *2.2(A1) *2.3(A2) *2.4(VSS) *2.7(WP) C42.1
P0[19]: *2.5(SDA) R39#2.2  [project net I2C_SDA]
P0[20]: *2.6(SCL) R40#2.2  [project net I2C_SCL]
VIO_3V3X: *2.8(VCC) C42.2 R39#2.1 R40#2.1

### Notes on the sheet
- I2C-E2PROM
- Yu-Jhen Cheng

### Library data of the parts
C42 = CAPC_100n_0805: as C2 on sheet Base Board; Package / Case: 0805 (2012 metric); Supplier 1: Digi-Key; Supplier Part Number 1: 399-1170-1-ND
R39#2 R40#2 = RES_330R_0402_5%: as R9 on sheet Base Board; Package / Case: 0402 (1005 Metric); Supplier 1: Digi-Key; Supplier Part Number 1: 311-330JRCT-ND; ComponentLink1URL: http://www.yageo.com/documents/recent/PYu-RC0402_51_RoHS_L_6.pdf; ComponentLink1Description: http://www.yageo.com/documents/recent/PYu-RC0402_51_RoHS_L_6.pdf

## Sheet USB Device.SchDoc: USB ABCDE
size A3; Date: 2015/04/02; Author: QWER
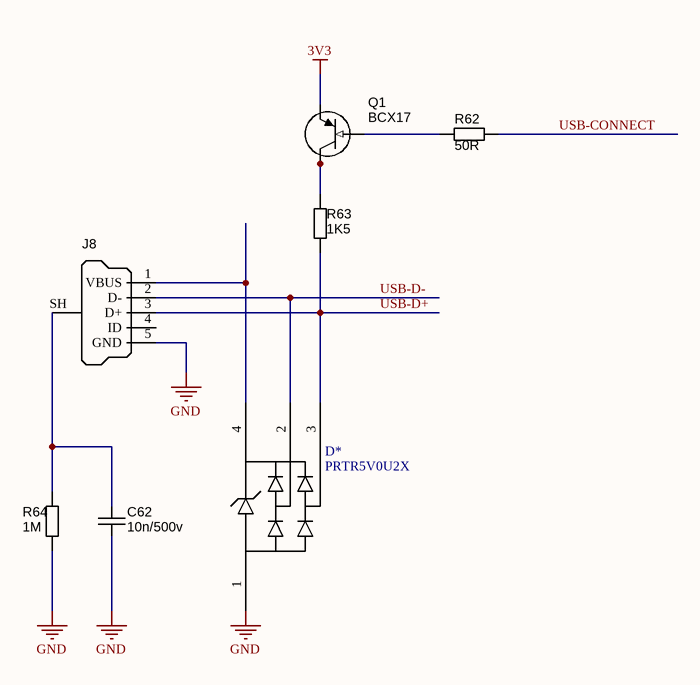
[diagram p4: USB Device.SchDoc]

### Parts
C62  value 10n/500v  [CAPC2012N]  (hidden comment: approved sub OK)
D*  PRTR5V0U2X
J8  USB Micro Type B  [USB_Micro-B_FCI_SMD]  (value not drawn)
Q1  Manufacturer Part Number 1: BCX17  [SOT23_213]  (hidden comment: PNP)
R62  value 50R  [RESC1005N]  (hidden comment: Thick Film)
R63  value 1K5  [RESC1005N]  (hidden comment: Thick Film)
R64  value 1M  [RESC1005N]  (hidden comment: Thick Film)

### Nets
3V3: Q1.3(E)
GND: C62.2 D*.1(GND) J8.5(GND) R64.1
USB-CONNECT: R62.1  [project net P2[9]]
USB-D+: D*.3(I/O_2) J8.3(D+) R63.2
USB-D-: D*.2(I/O_1) J8.2(D-)
NetC62_1: C62.1 J8.SH(Shell) R64.2
NetD*_4: D*.4(VCC) J8.1(VBUS)
NetQ1_1: Q1.1(B) R62.2
NetQ1_2: Q1.2(C) Q1.4(C) R63.1

Not connected (* = marked no-connect by the designer): J8 4(ID)

### Library data of the parts
C62 = CAPC_100n_0805: as C2 on sheet Base Board; Package / Case: 0805 (2012 metric); Supplier 1: Digi-Key; Supplier Part Number 1: 399-1170-1-ND
J8 = USB_Micro_TypeB_FCI: Connector SMD-THD USB Micro Type B middle mount; Manufacturer 1: FCI; Manufacturer Part Number 1: 10103593-0001LF; Package / Case: SMD/THD mid-mount; Supplier 1: Digi-Key; Supplier Part Number 1: 609-4049-1-ND
Q1 = PNP_NSS60600MZ4T1G: Transistor SMD PNP 60V 6A 800mW SOT-223; Manufacturer 1: ON Semiconductor; Ratings: 60V; 6A; 800mW; Material: Si; Package / Case: SOT-223; Transistor Type: PNP; Mounting Type: Surface Mount; Supplier 1: Digi-Key; Supplier Part Number 1: NSS60600MZ4T1GOSCT-ND
R62-R64 = RES_330R_0402_5%: as R9 on sheet Base Board; Package / Case: 0402 (1005 Metric); Supplier 1: Digi-Key; Supplier Part Number 1: 311-330JRCT-ND; ComponentLink1URL: http://www.yageo.com/documents/recent/PYu-RC0402_51_RoHS_L_6.pdf; ComponentLink1Description: http://www.yageo.com/documents/recent/PYu-RC0402_51_RoHS_L_6.pdf

## Sheet Etherent.SchDoc: Motor Monitoring
size A3; Organization: NTUST EE-305; Address1: No.43, Sec. 4, Keelung Rd.; Address2: Da’an Dist.; Address3: Taipei 106; Address4: Taiwan (R.O.C.); Revision: 2.0; SheetNumber: 2; SheetTotal: 4
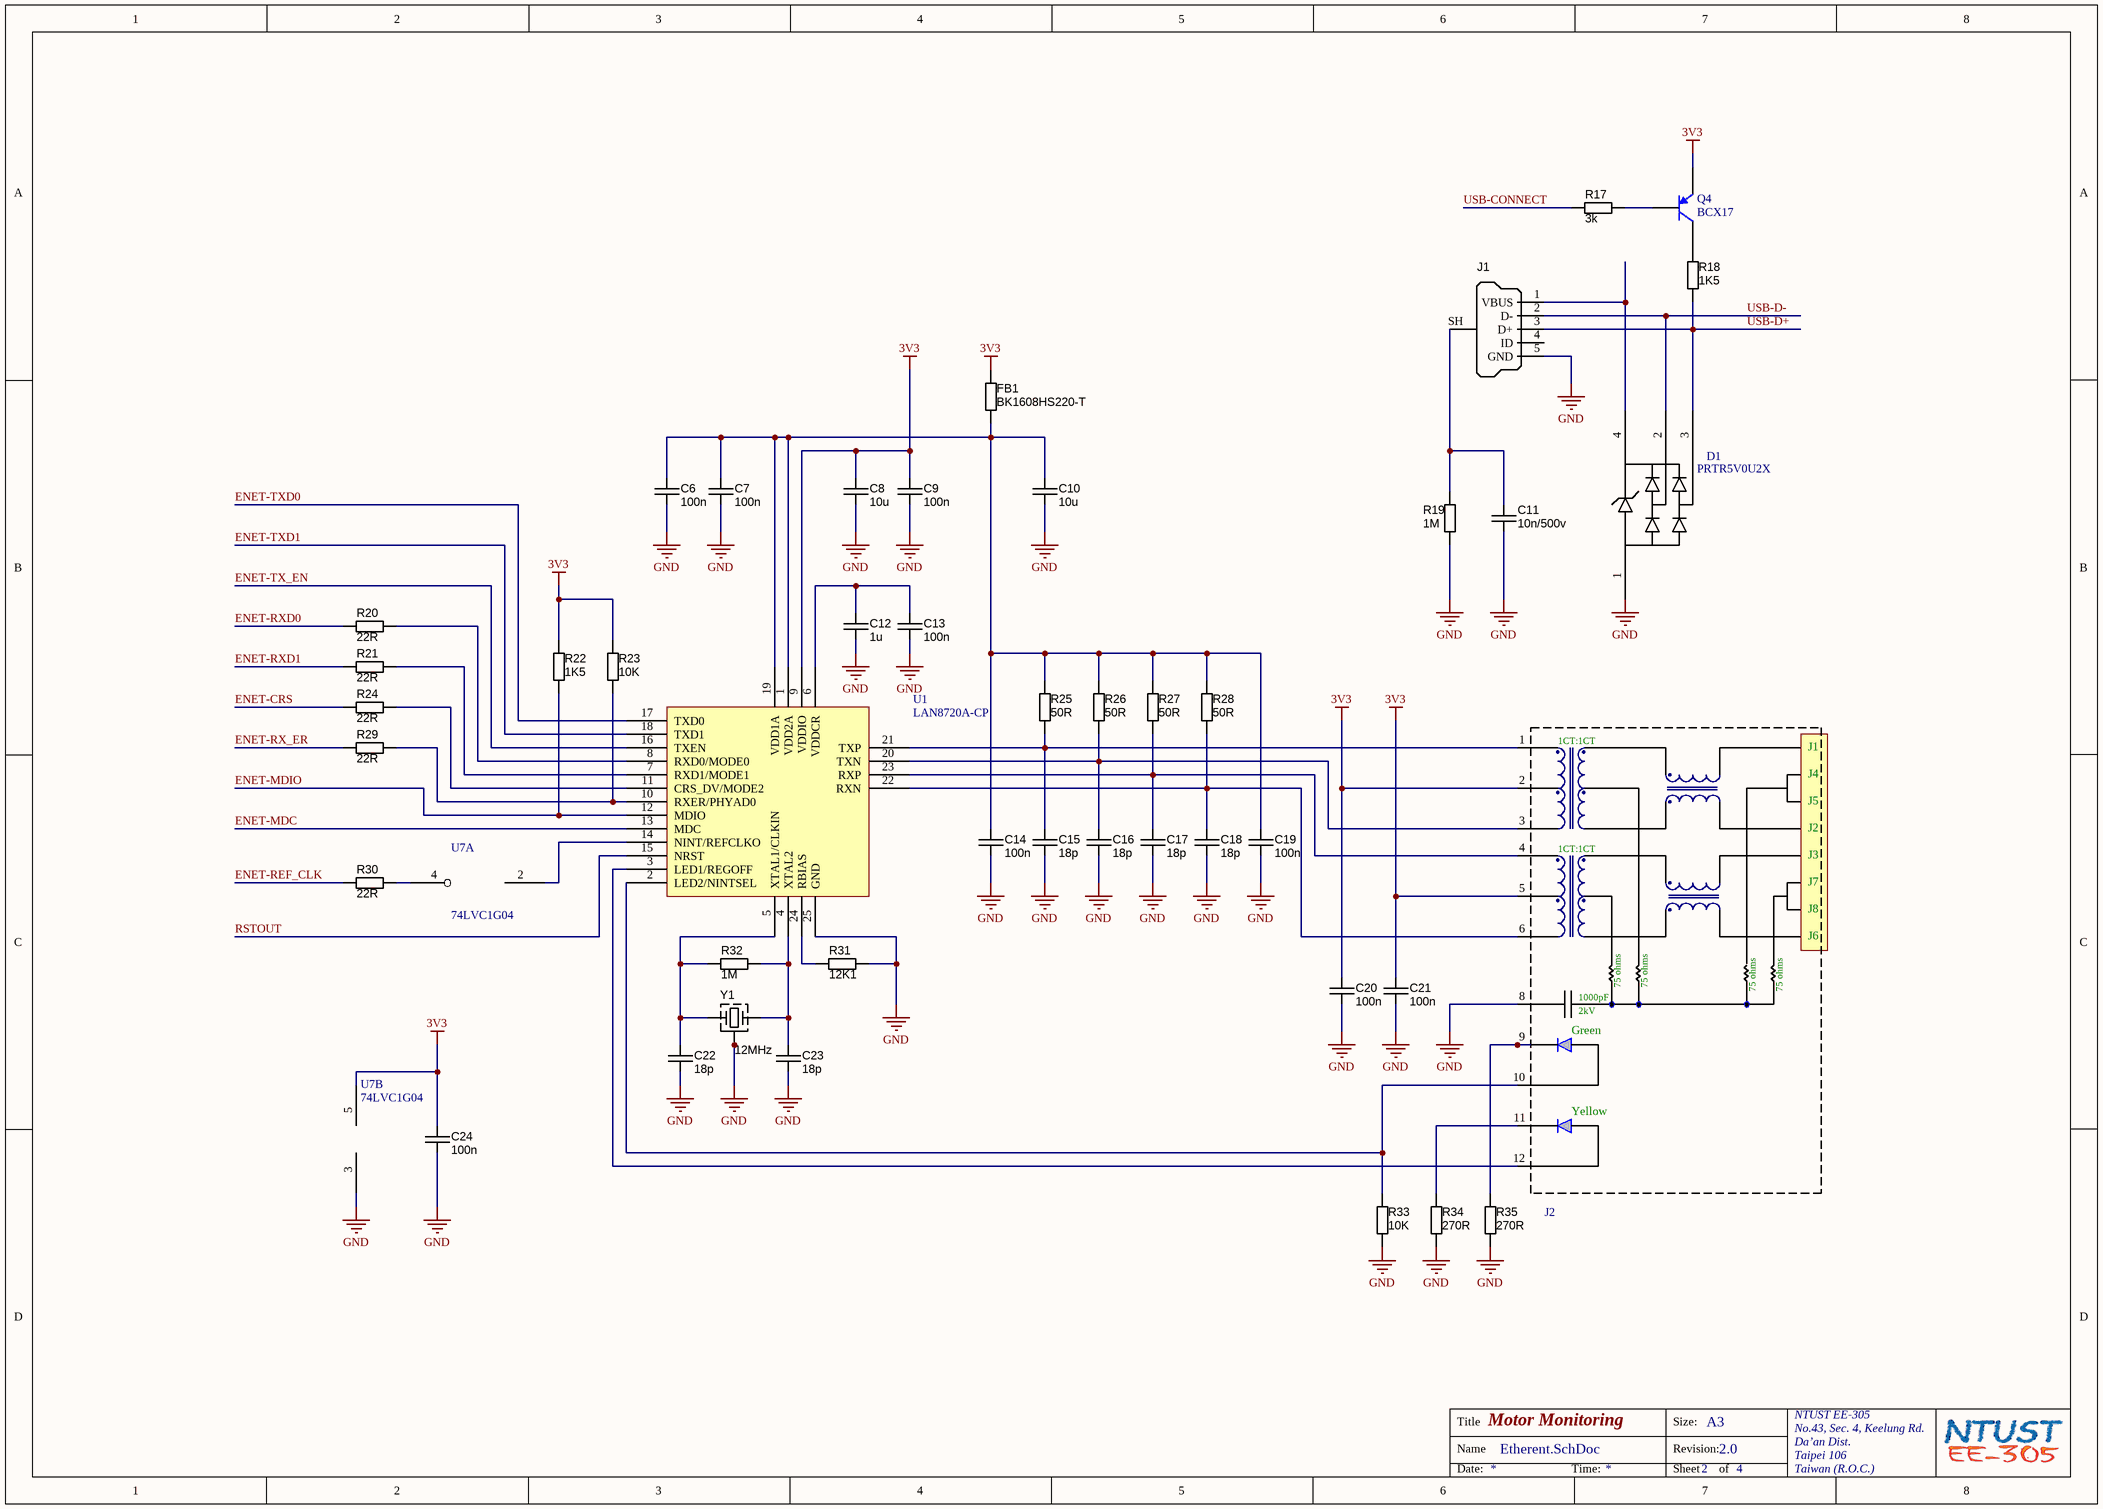
[diagram p5: Etherent.SchDoc]

### Parts
(Parts that share a designator on the sheet are numbered #1, #2 ... from top to bottom, then left to right.)
C6#2  value 100n  [CAPC1608N]  (hidden comment: approved sub OK)
C7#2  value 100n  [CAPC1608N]  (hidden comment: approved sub OK)
C8#2  value 10u  [CAPC1608N]  (hidden comment: approved sub OK)
C9#2  value 100n  [CAPC1608N]  (hidden comment: approved sub OK)
C10#2  value 10u  [CAPC3216N]  (hidden comment: approved sub OK)
C11#2  value 10n/500v  [CAPC1608N]  (hidden comment: approved sub OK)
C12#2  value 1u  [CAPC2012N]  (hidden comment: approved sub OK)
C13#2  value 100n  [CAPC1608N]  (hidden comment: approved sub OK)
C14#2  value 100n  [CAPC1608N]  (hidden comment: approved sub OK)
C15#2  value 18p  [CAPC1005N]  (hidden comment: approved sub OK)
C16#2  value 18p  [CAPC1005N]  (hidden comment: approved sub OK)
C17#2  value 18p  [CAPC1005N]  (hidden comment: approved sub OK)
C18#2  value 18p  [CAPC1005N]  (hidden comment: approved sub OK)
C19#2  value 100n  [CAPC1608N]  (hidden comment: approved sub OK)
C20  value 100n  [CAPC1608N]  (hidden comment: approved sub OK)
C21  value 100n  [CAPC1608N]  (hidden comment: approved sub OK)
C22  value 18p  [CAPC1005N]  (hidden comment: approved sub OK)
C23  value 18p  [CAPC1005N]  (hidden comment: approved sub OK)
C24  value 100n  [CAPC1608N]  (hidden comment: approved sub OK)
D1  PRTR5V0U2X  [SOT190P230X120-4N]
FB1  value BK1608HS220-T  [CAPC3216N]  (hidden comment: Thick Film)
J1#2  USB Micro Type B  [USB_Micro-B_FCI_SMD]  (value not drawn)
J2#2  (no value)  [ARJC01-111002T]
Q4  BCX17  [SOT23-3N]
R17#2  value 3k  [RESC1005N]  (hidden comment: Thick Film)
R18#2  value 1K5  [RESC1005N]  (hidden comment: Thick Film)
R19#2  value 1M  [RESC1005N]  (hidden comment: Thick Film)
R20#2  value 22R  [RESC1005N]  (hidden comment: Thick Film)
R21  value 22R  [RESC1005N]  (hidden comment: Thick Film)
R22  value 1K5  [RESC1005N]  (hidden comment: Thick Film)
R23  value 10K  [RESC1005N]  (hidden comment: Thick Film)
R24  value 22R  [RESC1005N]  (hidden comment: Thick Film)
R25  value 50R  [RESC1005N]  (hidden comment: Thick Film)
R26  value 50R  [RESC1005N]  (hidden comment: Thick Film)
R27  value 50R  [RESC1005N]  (hidden comment: Thick Film)
R28  value 50R  [RESC1005N]  (hidden comment: Thick Film)
R29  value 22R  [RESC1005N]  (hidden comment: Thick Film)
R30  value 22R  [RESC1005N]  (hidden comment: Thick Film)
R31  value 12K1  [RESC1005N]  (hidden comment: Thick Film)
R32  value 1M  [RESC1005N]  (hidden comment: Thick Film)
R33  value 10K  [RESC1005N]  (hidden comment: Thick Film)
R34  value 270R  [RESC1005N]  (hidden comment: Thick Film)
R35  value 270R  [RESC1005N]  (hidden comment: Thick Film)
U1  LAN8720A-CP  [QFN-MJ24]
U7  74LVC1G04  [SOT-23-CT5_N]  (parts A,B of 2)
Y1  12MHz  [CRYSTAL_4-LCC]

### Nets
3V3: C8#2.1 C9#2.1 C20.1 C21.1 C24.1 FB1.2 J2#2.2(CTD) J2#2.5(CRD) Q4.2(E) R22.1 R23.1 U1.9(VDDIO) U7.5(VCC)
GND: C6#2.2 C7#2.2 C8#2.2 C9#2.2 C10#2.2 C11#2.2 C12#2.2 C13#2.2 C14#2.1 C15#2.1 C16#2.1 C17#2.1 C18#2.1 C19#2.1 C20.2 C21.2 C22.1 C23.1 C24.2 D1.1(GND) J1#2.5(GND) J2#2.8(Shield) R19#2.1 R31.1 R33.2 R34.1 R35.1 U1.25(GND) U7.3(GND) Y1.2(GND) Y1.4(GND)
ENET-CRS: R24.1
ENET-MDC: U1.13(MDC)
ENET-MDIO: R22.2 U1.12(MDIO)
ENET-REF_CLK: R30.1
ENET-RX_ER: R29.2
ENET-RXD0: R20#2.1
ENET-RXD1: R21.1
ENET-TX_EN: U1.16(TXEN)
ENET-TXD0: U1.17(TXD0)
ENET-TXD1: U1.18(TXD1)
RSTOUT: U1.15(NRST)
USB-CONNECT: R17#2.2  [project net P2[9]]
USB-D+: D1.3(I/O_2) J1#2.3(D+) R18#2.2
USB-D-: D1.2(I/O_1) J1#2.2(D-)
NetC6#2_1: C6#2.1 C7#2.1 C10#2.1 C14#2.2 C19#2.2 FB1.1 R25.1 R26.1 R27.1 R28.1 U1.1(VDD2A) U1.19(VDD1A)
NetC11#2_1: C11#2.1 J1#2.SH(Shell) R19#2.2
NetC12#2_1: C12#2.1 C13#2.1 U1.6(VDDCR)
NetC15#2_2: C15#2.2 J2#2.1(TD+) R25.2 U1.21(TXP)
NetC16#2_2: C16#2.2 J2#2.3(TD-) R26.2 U1.20(TXN)
NetC17#2_2: C17#2.2 J2#2.4(RD+) R27.2 U1.23(RXP)
NetC18#2_2: C18#2.2 J2#2.6(RD-) R28.2 U1.22(RXN)
NetC22_2: C22.2 R32.1 U1.5(XTAL1/CLKIN) Y1.1(X)
NetC23_2: C23.2 R32.2 U1.4(XTAL2) Y1.3(X)
NetD1_4: D1.4(VCC) J1#2.1(VBUS)
NetJ2#2_9: J2#2.9 R35.2
NetJ2#2_10: J2#2.10 R33.1 U1.2(LED2/NINTSEL)
NetJ2#2_11: J2#2.11 R34.2
NetJ2#2_12: J2#2.12 U1.3(LED1/REGOFF)
NetQ4_1: Q4.1(B) R17#2.1
NetQ4_3: Q4.3(C) R18#2.1
NetR20#2_2: R20#2.2 U1.8(RXD0/MODE0)
NetR21_2: R21.2 U1.7(RXD1/MODE1)
NetR23_2: R23.2 R29.1 U1.10(RXER/PHYAD0)
NetR24_2: R24.2 U1.11(CRS_DV/MODE2)
NetR30_2: R30.2 U7.4
NetR31_2: R31.2 U1.24(RBIAS)
NetU1_14: U1.14(NINT/REFCLKO) U7.2

Not connected (* = marked no-connect by the designer): J1#2 4(ID)

### Notes on the sheet
- Title
- Name
- Size:
- Revision:
- A3
- Date:
- Time:
- Sheet
- of
- (in symbol ARJC01-111002T) 1CT:1CT; J1; J4; J5; J3; J7; J8; J6; 75 ohms; 1000pF; 2kV; Green; Yellow

### Library data of the parts
C6#2 C7#2 C8#2 C9#2 C10#2 C11#2 C12#2 C13#2 C14#2 C15#2 C16#2 C17#2 C18#2 C19#2 C20-C24 = CAPC_100n_0805: as C2 on sheet Base Board; Package / Case: 0805 (2012 metric); Supplier 1: Digi-Key; Supplier Part Number 1: 399-1170-1-ND
FB1 R17#2 R18#2 R19#2 R20#2 R21-R35 = RES_330R_0402_5%: as R9 on sheet Base Board; Package / Case: 0402 (1005 Metric); Supplier 1: Digi-Key; Supplier Part Number 1: 311-330JRCT-ND; ComponentLink1URL: http://www.yageo.com/documents/recent/PYu-RC0402_51_RoHS_L_6.pdf; ComponentLink1Description: http://www.yageo.com/documents/recent/PYu-RC0402_51_RoHS_L_6.pdf
J1#2 = USB_Micro_TypeB_FCI: as J8 on sheet USB Device; Package / Case: SMD/THD mid-mount; Supplier 1: Digi-Key; Supplier Part Number 1: 609-4049-1-ND
J2#2 = ARJC01-111002T: 10/100 Base-Tx Tap Up RJ45 with LED
Q4 = BCX17: PNP General Purpose Transistors; Published: 8-Jun-2000; LatestRevisionDate: 15-Jan-2003; LatestRevisionNote: PCB Footprint 'BCY-W3/D4.7' replaced; DatasheetVersion: 1997; PackageVersion: Sep-1998; PackageReference: TO-92A; Publisher: Altium Limited; PackageDescription: TO, Flat Index; 3 In-Line, Axial Leads; Body Dia. 4.5mm; Leads 0.51 x 0.48 mm (max); ComponentLink1Description: Manufacturer Link; ComponentLink1URL: http://www.fairchildsemi.com/; ComponentLink2Description: Datasheet; ComponentLink2URL: http://www.fairchildsemi.com/ds/2N%2F2N3906.pdf
Y1 = CRYSTAL_27M12: as Y3 on sheet LPC1769; Package / Case: 2.5mm pitch; Material: Ceramic; Supplier 1: Digi-Key; Supplier Part Number 1: 887-1329-1-ND; Type: MHz Crystal; Frequency Tolerance: ?0ppm; Operating Temperature: -20蚓 ~ 70蚓; Mounting Type: Surface Mount; Size / Dimension: 0.126" L x 0.098" W (3.20mm x 2.50mm); ComponentLink1URL: http://www.txccrystal.com/images/pdf/7m-accuracy.pdf; ComponentLink1Description: http://www.txccrystal.com/images/pdf/7m-accuracy.pdf

## Nets that join several sheets
3V3: LPC1769 (21 pins), SPI peripherals (15 pins), USB Device (Q1.3), Etherent (13 pins)
GND: Base Board (23 pins), LPC1769 (41 pins), SPI peripherals (18 pins), USB Device (C62.2 D*.1 J8.5 R64.1), Etherent (31 pins)
VCC: Base Board (J2#1.1 J3#1.1 J4.1), LPC1769 (7 pins)
BTN_DOWN: Base Board (R17#1.1), LPC1769 (U3.69)
ENET-CRS: LPC1769 (U3.92), Etherent (R24.1)
ENET-MDC: LPC1769 (U3.87), Etherent (U1.13)
ENET-MDIO: LPC1769 (U3.86), Etherent (R22.2 U1.12)
ENET-REF_CLK: LPC1769 (U3.88), Etherent (R30.1)
ENET-RX_ER: LPC1769 (U3.89), Etherent (R29.2)
ENET-RXD0: LPC1769 (U3.91), Etherent (R20#2.1)
ENET-RXD1: LPC1769 (U3.90), Etherent (R21.1)
ENET-TX_EN: LPC1769 (U3.93), Etherent (U1.16)
ENET-TXD0: LPC1769 (U3.95), Etherent (U1.17)
ENET-TXD1: LPC1769 (U3.94), Etherent (U1.18)
FLASH_SSEL: LPC1769 (U3.80), SPI peripherals (R52.2 U5#2.4)
I2C_SCL: LPC1769 (U3.58), SPI peripherals (R45.2 U6.6), I2C-E2PROM (*2.6 R40#2.2)
I2C_SDA: LPC1769 (U3.59), SPI peripherals (R46.2 U6.5), I2C-E2PROM (*2.5 R39#2.2)
P0[6]: LPC1769 (U3.79), SPI peripherals (R59.2)
P0[7]: LPC1769 (U3.78), SPI peripherals (R55.2 R57.1 U5#2.2)
P0[8]: LPC1769 (U3.77), SPI peripherals (R51.1 R58.2)
P0[9]: LPC1769 (U3.76), SPI peripherals (R53.2 R56.2 U5#2.1)
P0[15]: Base Board (R9.1), LPC1769 (U3.62)
P0[16]: Base Board (R10.1), LPC1769 (U3.63)
P0[17]: Base Board (R16.1), LPC1769 (U3.61)
P0[26]: Base Board (R11.1), LPC1769 (U3.6)
P2[3]: Base Board (R15.1), LPC1769 (U3.70)
P2[9]: LPC1769 (U3.64), USB Device (R62.1), Etherent (R17#2.2)
RESET: LPC1769 (LED5.K R38.1 R42.1 U3.17), SPI peripherals (U5#2.3 U5#2.5)
RSTOUT: LPC1769 (U3.14), Etherent (U1.15)
USB-D+: LPC1769 (R40#1.2), USB Device (D*.3 J8.3 R63.2), Etherent (D1.3 J1#2.3 R18#2.2)
USB-D-: LPC1769 (R41.2), USB Device (D*.2 J8.2), Etherent (D1.2 J1#2.2)